# Altium schematic sheet Power.SchDoc
size A; SheetNumber: 2
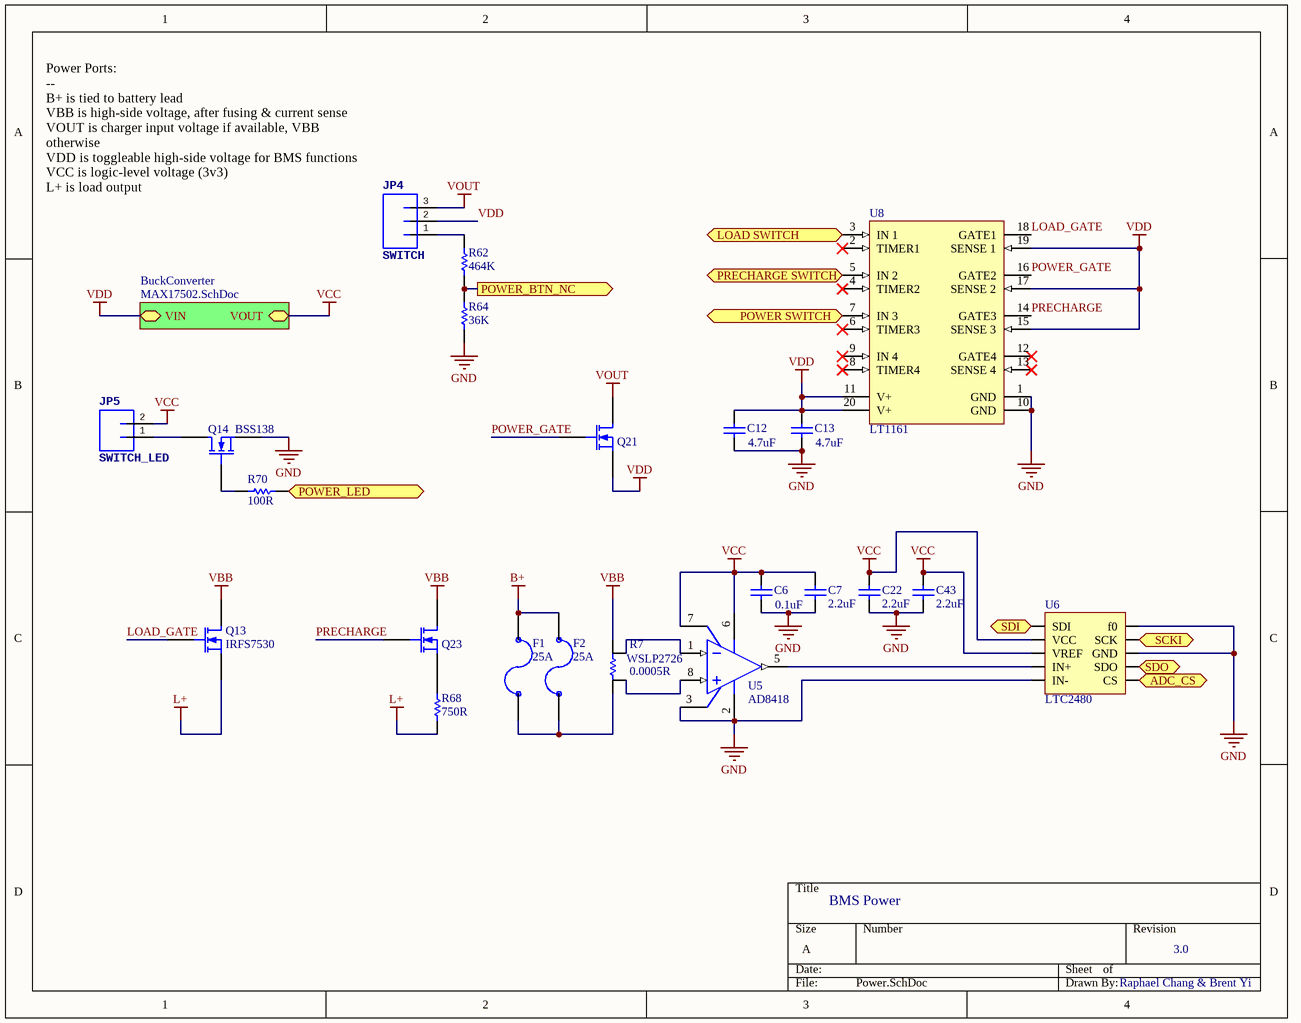
[diagram p0: Power.SchDoc]

## Parts
C6  0.1uF  [CAPC0603(1608)55_N]
C7  value 2.2uF  [CAPC0603(1608)100_N]
C12  value 4.7uF  [CAPC1210(3225)280_N]
C13  value 4.7uF  [CAPC1210(3225)280_N]
C22  2.2uF  [CAPC0603(1608)55_N]
C43  2.2uF  [CAPC0603(1608)55_N]
F1  25A  [1206_FUSE]
F2  25A  [1206_FUSE]
JP4  SWITCH  [JST-3-PTH-VERT]
JP5  SWITCH_LED  [JST-2-PTH-VERT]
Q13  IRFS7530  [DPAK127P1525X483-7N]
Q14  BSS138  [SOT23-3]
Q21  FDS5672  [SOIC127P600X175-8N]  (value not drawn)
Q23  BSS138  [SOT23-3]  (value not drawn)
R7  WSLP2726  value 0.0005R  [WSL2726]
R62  464K  [RESC0603(1608)_L]
R64  36K  [RESC0603(1608)_L]
R68  750R  [RESC2512(6432)_N]
R70  100R  [RESC0603(1608)_L]
U5  AD8418  [MSOP-8]
U6  LTC2480  [MSOP10]
U8  LT1161  [LT-SW-20_M]

## Sub-sheets
BuckConverter = MAX17502.SchDoc: VIN, VOUT

## Ports
ADC_CS (in), LOAD SWITCH (in), POWER SWITCH (in), POWER_BTN_NC (out), POWER_LED (in), PRECHARGE SWITCH (in), SCKI (in), SDI (in), SDO (out)

## Nets
B+: F1.1 F2.1
GND: C6.2 C7.2 C12.1 C13.1 C22.1 C43.1 Q14.3(S) R64.1 U5.2(GND) U5.3(VREF2) U6.4(IN-) U6.5(f0) U6.7(GND) U8.1(GND) U8.10(GND)
L+: Q13.3(S) R68.1
VBB: Q13.2(D) Q23.2(D) R7.2
VCC: C6.1 C7.1 C22.2 C43.2 JP5.2 U5.6(VS) U5.7(VREF1) U6.1(VCC) U6.2(VREF) ; sheet BuckConverter/VOUT
VDD: C12.2 C13.2 JP4.2 Q21.3(S) U8.11(V+) U8.15(SENSE_3) U8.17(SENSE_2) U8.19(SENSE_1) U8.20(V+) ; sheet BuckConverter/VIN
VOUT: JP4.3 Q21.2(D)
ADC_CS: U6.9(CS) ; port ADC_CS
LOAD SWITCH: U8.3(IN_1) ; port LOAD SWITCH
LOAD_GATE: Q13.1(G) U8.18(GATE1)
POWER SWITCH: U8.7(IN_3) ; port POWER SWITCH
POWER_BTN_NC: R62.1 R64.2 ; port POWER_BTN_NC
POWER_GATE: Q21.1(G) U8.16(GATE2)
POWER_LED: R70.1 ; port POWER_LED
PRECHARGE: Q23.1(G) U8.14(GATE3)
PRECHARGE SWITCH: U8.5(IN_2) ; port PRECHARGE SWITCH
SCKI: U6.6(SCK) ; port SCKI
SDI: U6.0(SDI) ; port SDI
SDO: U6.8(SDO) ; port SDO
NetF1_2: F1.2 F2.2 R7.1
NetJP4_1: JP4.1 R62.2
NetJP5_1: JP5.1 Q14.2(D)
NetQ14_1: Q14.1(G) R70.2
NetQ23_3: Q23.3(S) R68.2
NetR7_3: R7.3 U5.8(IN+)
NetR7_4: R7.4 U5.1(IN-)
NetU5_5: U5.5(OUT) U6.3(IN+)

Not connected (* = marked no-connect by the designer): U8 2(TIMER1)* 4(TIMER2)* 6(TIMER3)* 8(TIMER4)* 9(IN_4)* 12(GATE4)* 13(SENSE_4)*

## Notes on the sheet
- (near JP4) Power Ports:
  --
  B+ is tied to battery lead
  VBB is high-side voltage, after fusing & current sense
  VOUT is charger input voltage if available, VBB otherwise
  VDD is toggleable high-side voltage for BMS functions
  VCC is logic-level voltage (3v3)
  L+ is load output
- BMS Power
- 3.0
- Raphael Chang & Brent Yi

## Library data of the parts
C6 = CMP-1035-02762-1: CAP 2.2uF 16V Â±10% 0603 (1608 Metric) Thickness 0.55mm SMD; Case-EIA: 0603; Case-Metric: 1608; Max Thickness: 0.55 mm; Technology: SMT; Value: 0.1uF; Rated Voltage: 16 V; Tolerance: Â±10%
C7 = CMP-1035-02730-1: CAP 1uF 6.3V Â±10% 0603 (1608 Metric) Thickness 1mm SMD; Case-EIA: 0603; Case-Metric: 1608; Rated Voltage: 6.3 V; Max Thickness: 1 mm; Technology: SMT; Tolerance: Â±10%
C12 C13 = CMP-1038-02301-1: CAP 100uF 10V Â±10% 1210 (3225 Metric) Thickness 2.8mm SMD; Case-EIA: 1210; Case-Metric: 3225; Rated Voltage: 6.3 V; Tolerance: Â±10%; Technology: SMT; Max Thickness: 2.8 mm
C22 C43 = CMP-1035-02751-1: CAP 2.2uF 4V Â±10% 0603 (1608 Metric) Thickness 0.55mm SMD; Case-EIA: 0603; Case-Metric: 1608; Tolerance: Â±10%; Rated Voltage: 4 V; Technology: SMT; Max Thickness: 0.55 mm; Value: 2.2uF
F1 F2 = FUSE 1206: Fuse; Supplier 1: Allied; Supplier Part Number 1: 70160157
JP4 = JST_3
JP5 = JST_2_VERT
Q13 Q14 Q23 = MOSFET-N: N-Channel MOSFET; Published: 8-Jun-2000; LatestRevisionDate: 17-Jul-2002; LatestRevisionNote: Re-released for DXP Platform.; PackageVersion: 1995/1996; PackageReference: E3; Publisher: Altium Limited; PackageDescription: TO, Flat Index; 3 In-Line, Axial Leads; Body Dia. 4.6mm; Lead Dia. 0.5 mm (max)
Q21 = MOSFET-N: N-Channel MOSFET; pin to pad: 1>2 2>3 3>1; Published: 8-Jun-2000; LatestRevisionDate: 17-Jul-2002; LatestRevisionNote: Re-released for DXP Platform.; PackageVersion: 1995/1996; PackageReference: E3; Publisher: Altium Limited; PackageDescription: TO, Flat Index; 3 In-Line, Axial Leads; Body Dia. 4.6mm; Lead Dia. 0.5 mm (max)
R7 = WSLP2726: Resistor; Published: 8-Jun-2000; LatestRevisionDate: 17-Jul-2002; LatestRevisionNote: Re-released for DXP Platform.; PackageReference: AXIAL-0.3; Publisher: Altium Limited; PackageDescription: Axial Device, Thru-Hole; 2 Leads; 0.3 in Pin Spacing
R62 = CMP-1012-00811-1: 464K 0.1W 1% 0603 (1608 Metric)  SMD; Value: 464000.00 Ohm; Case-Metric: 1608; Case-EIA: 0603; Tolerance: 1 %; Power: 0.1 W; Technology: SMT
R64 = CMP-1012-00685-1: 36K 0.1W 1% 0603 (1608 Metric)  SMD; Case-Metric: 1608; Value: 36000.00 Ohm; Case-EIA: 0603; Technology: SMT; Power: 0.1 W; Tolerance: 1 %
R68 = CMP-1018-00496-1: 750R 1W 1% 2512 (6432 Metric)  SMD; Value: 750.00 Ohm; Case-EIA: 2512; Case-Metric: 6432; Tolerance: 1 %; Technology: SMT; Power: 1 W
R70 = CMP-1012-00050-1: 100R 0.1W 5% 0603 (1608 Metric)  SMD; Case-EIA: 0603; Case-Metric: 1608; Tolerance: 5 %; Technology: SMT; Value: 100R; Power: 0.1 W
U8 = CMP-0479-00631-1: Quad Protected High-Side MOSFET Driver, 8 to 48 V Vin, 20-pin SOIC (SW-20), -40 to 85 degC, Pb-Free; Manufacturer: Linear Technology; PartNumber: LT1161ISW#PBF; ComponentLink3URL: http://cds.linear.com/docs/en/packaging/SO_20_05-08-1620.pdf; RoHS: TRUE; ComponentLink1URL: http://www.linear.com/; PackageDescription: 20-Pin Plastic Small Outline, Body 12.80 x 7.49 mm, Pitch 1.27 mm; DatasheetVersion: Rev. A; ComponentLink1Description: Manufacturer URL; ComponentLink3Description: Package Specification; ComponentLink2URL: http://cds.linear.com/docs/en/datasheet/1161fa.pdf; PackageReference: SW-20; PackageVersion: Jun-10; ComponentLink2Description: Datasheet; Mounting Technology: Surface Mount